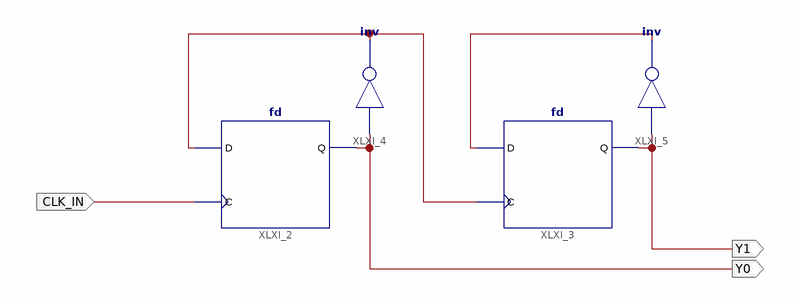
[diagram p0: schematic sheet 1]
// Xilinx ISE schematic Counter0to3.sch (spartan6) as structural Verilog: 4 symbols, 3 ports
module Counter0to3 (
  input  CLK_IN,
  output Y1,
  output Y0
);

  wire XLXN_3, XLXN_4;

  fd XLXI_2 (.C(CLK_IN), .D(XLXN_3), .Q(Y0));
  fd XLXI_3 (.C(XLXN_3), .D(XLXN_4), .Q(Y1));
  not XLXI_4 (XLXN_3, Y0);
  not XLXI_5 (XLXN_4, Y1);
endmodule
